# EAGLE schematic V4-AddRS485-1W-V01-016-defect (EAGLE 9.1.1)
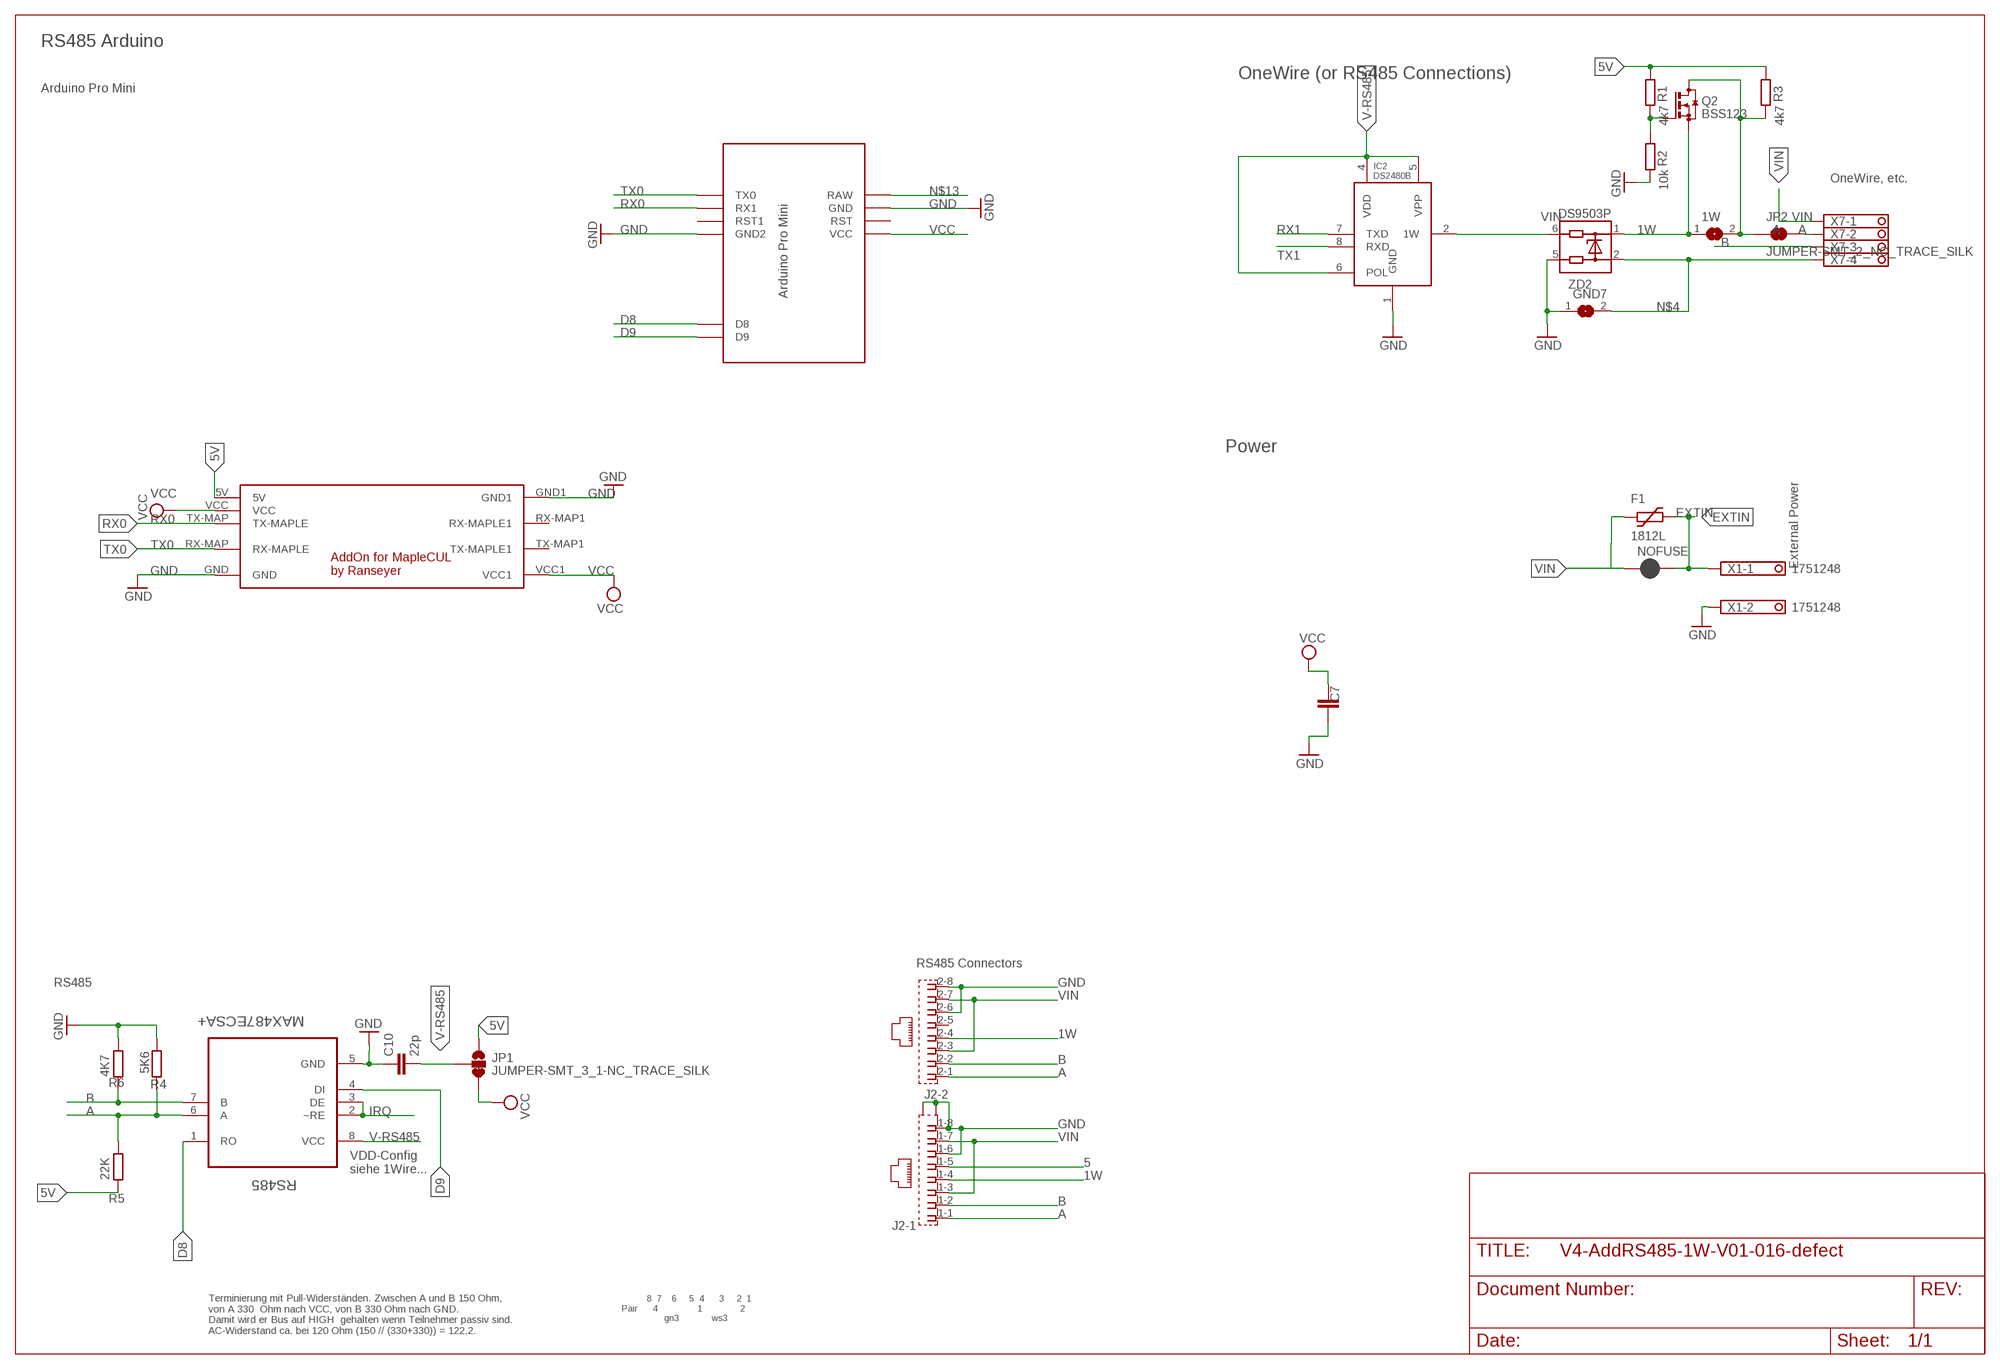
[diagram p0: schematic, sheet 1]

## Parts
1W  SJ  [SJ]
C7  C-EUC1812  [C1812]
C10  22p  C-EUC0805  [C0805]
F1  1812L  [1812L]
GND7  SJ  [SJ]
IC2  DS2480B  [SO08]
J2  RJ45_2X_S  [RJ45_2X_S]
JP1  JUMPER-SMT_3_1-NC_TRACE_SILK  [SMT-JUMPER_3_1-NC_TRACE_SILK]
JP2  JUMPER-SMT_2_NC_TRACE_SILK  [SMT-JUMPER_2_NC_TRACE_SILK]
NOFUSE  JUMPER-SMT_2_NC_PASTE_NO-SILK  [SMT-JUMPER_2_NC_PASTE_NO-SILK]
Q2  BSS123  [SOT23]
R1  4k7  R-EU_R0805  [R0805]
R2  10k  R-EU_R0805  [R0805]
R3  4k7  R-EU_R0805  [R0805]
R4  5K6  R-EU_R0805  [R0805]
R5  22K  R-EU_R0805  [R0805]
R6  4K7  R-EU_R0805  [R0805]
RS485  MAX487ECSA+  [SOIC127P600X175-8N]
U$2  MAPLE-CUL-ADDON-V01  [MAPLE-CUL-V01]
U$3  MARTIN-PRO-MINI-RS485  [MARTIN-PRO-MINI-RS485]
X1  1751248  [1751248]
X7  1751264  [1751264]
ZD2  DS9503P  [TSOC6]

## Nets
1W: 1W.1 J2.1-4 J2.2-4 Q2.2(S) ZD2.1
5: J2.1-5
5V: JP1.1 R1.1 R3.1 R5.1 U$2.5V
A: 1W.2 J2.1-1 J2.2-1 JP2.1 JP2.2 Q2.3(D) R3.2 R4.2 R5.2 RS485.6(A) X7.2
B: J2.1-2 J2.2-2 R6.1 RS485.7(B) X7.3
D8: RS485.1(RO) U$3.D8
D9: RS485.4(DI) U$3.D9
EXTIN [PWR]: F1.P$2 NOFUSE.2 X1.1
GND [PWR]: C7.1 C10.1 GND7.1 IC2.1(GND) J2.1-6 J2.1-8 J2.2-6 J2.2-8 J2.G1(-1:S2) J2.G3(-1:S1) R2.2 R4.1 R6.2 RS485.5(GND) U$2.GND U$2.GND1 U$3.GND U$3.GND1(GND2) X1.2 ZD2.5
IRQ: RS485.2(~RE) RS485.3(DE)
N$1: C10.2 JP1.2
N$3: IC2.2(1W) ZD2.6
N$4 [PWR]: GND7.2 X7.4 ZD2.2
N$6: Q2.1(G) R1.2 R2.1
N$13: U$3.RAW
RX0: U$2.TX-MAP(TX-MAPLE) U$3.RX1
RX1: IC2.7(TXD)
TX0: U$2.RX-MAP(RX-MAPLE) U$3.TX0
TX1: IC2.8(RXD)
V-RS485 [PWR]: IC2.4(VDD) IC2.5(VPP) IC2.6(POL) RS485.8(VCC)
VCC [PWR]: C7.2 JP1.3 U$2.VCC U$2.VCC1 U$3.VCC
VIN [PWR]: F1.P$1 J2.1-3 J2.1-7 J2.2-3 J2.2-7 NOFUSE.1 X7.1
Unconnected: J2.2-5 U$2.RX-MAP1(RX-MAPLE1) U$2.TX-MAP1(TX-MAPLE1) U$3.RST U$3.RST1

## Notes on the sheet
- RS485 Arduino
- OneWire (or RS485 Connections)
- Arduino Pro Mini
- OneWire, etc.
- Power
- External Power
- RS485 Connectors
- RS485
- VDD-Config
  siehe 1Wire...
- 8  7    6     5  4      3     2  1
  Pair      4                1               2
                   gn3             ws3
- Terminierung mit Pull-Widerständen. Zwischen A und B 150 Ohm,
  von A 330  Ohm nach VCC, von B 330 Ohm nach GND. 
  Damit wird er Bus auf HIGH  gehalten wenn Teilnehmer passiv sind.
  AC-Widerstand ca. bei 120 Ohm (150 // (330+330)) = 122,2.

## Library data of the parts
1W GND7 = jumper:SJ: SMD solder JUMPER
C7 = rcl:C-EU: CAPACITOR, European symbol; SPICEPREFIX: C
C10 = rcl:C-EU: CAPACITOR, European symbol
F1 = ptc-littlefuse:1812L
IC2 = 1wire:DS2480B: RS232 to 1-Wire Host Adapter/Line Driver with Load Sensor This device is a onewire host and UART interface in one chip. It provides the complete DC/AC requirements for onewire communication, including overdrive speed mode and 12V EPROM programming. On the UART side, it can operate at 9.6kBaud (default), 19.2kBaud, 57.6kBaud, and 115.2kBaud. The RxD and TxD lines are operated at 0V/5V. The POL pin selects the RxD and TxD "polarity", that means straight-through or inverted. If POL is connected to GND, RxD and TxD behave properly for connection to inverted RS232 drivers, like the MC1488/1489 or MAX23x chips. If POL is connected to Vdd, RxD and TxD behave properly for direct connection to a 0V/5V UART chip. Important Notes: RxD and TxD are seen from the UART point of view, that means the DS2480B TxD pin is really an input and the DS2480B RxD pin is really an output. Vpp must be connected to 5V/Vdd if EPROM programming is not required. Vdd must be always lower than or equal to Vpp, otherwise the chip will be damaged. Best idea is to provide a separate 12V->5V/5mA voltage regulator from Vpp to Vdd if EPROM programming is required. Author: Jan Kandziora <jjj@gmx.de>
J2 = RJ45:RJ45_2X_S: AMP connector
JP1 = SparkFun-Jumpers:JUMPER-SMT_3_1-NC_TRACE: Normally closed trace jumper (1 of 2 connections) This jumper has a trace between two pads so it's normally closed (NC). The other connection is normally open (NO). Use a razor knife to open the connection. For best results follow the IPC guidelines for cutting traces: Cutout at least 0.063 mm (0.005 in). Remove all loose material to clean up the cut area. Seal the cut with an approved epoxy. Reapply solder to reclose the connection, or to close the NO connection.
JP2 = SparkFun-Jumpers:JUMPER-SMT_2_NC_TRACE: Normally closed trace jumper This jumper has a trace between two pads so it's normally closed (NC). Use a razor knife to open the connection. For best results follow the IPC guidelines for cutting traces: Cutout at least 0.063 mm (0.005 in). Remove all loose material to clean up the cut area. Seal the cut with an approved epoxy. Reapply solder to reclose the connection.
NOFUSE = SparkFun-Jumpers:JUMPER-SMT_2_NC_PASTE: Normally closed solder jumper This jumper has an aperture in the stencil to allow solder paste to bridge the split in the wire so it's normally closed (NC). Wick off the solder to open the connection. Reapply solder to reclose the connection.
Q2 = transistor-small-signal:BSS123: N-CHANNEL MOS FET
R1-R6 = rcl:R-EU_: RESISTOR, European symbol
RS485 = Maxim_By_element14_Batch_1:MAX487ECSA+: Low-Power, Slew-Rate-Limited RS-485/RS-422 Transceivers; MPN: MAX487ECSA+; OC_FARNELL: 9724532; OC_NEWARK: 68K4803; PACKAGE: SOIC-8; SUPPLIER: Maxim
U$2 = Martin-Communication-V4:MAPLE-CUL-ADDON-V01: AddOn for MAPLE-CUL V4.x
U$3 = Arduino-clone:MARTIN-PRO-MINI-RS485: ABK Pro-Mini Arduino Clone
X1 = con-phoenix-350:1751248: MKDS 1/ 2-3,5 Printklemme Nennstrom: 10 A Bemessungsspannung: 160 V Raster: 3,5 mm Polzahl: 2 Montageart: Löten Anschlussart: Schraubanschluss Anschlussrichtung vom Leiter zur Platine: 0° Source: http://eshop.phoenixcontact.com .. 1751248.pdf; OC_FARNELL: unknown; OC_NEWARK: unknown
X7 = con-phoenix-350:1751264: MKDS 1/ 4-3,5 Printklemme Nennstrom: 10 A Bemessungsspannung: 160 V Raster: 3,5 mm Polzahl: 4 Montageart: Löten Anschlussart: Schraubanschluss Anschlussrichtung vom Leiter zur Platine: 0° Source: http://eshop.phoenixcontact.com .. 1751264.pdf; MPN: 1751264; OC_FARNELL: unknown; OC_NEWARK: 10R0934
ZD2 = 1wire:DS9503: ESD Protection Diode with Resistors This ESD protection diode is designed especially for onewire host interfaces. Unlike the DS9502, it has two additional 5Ohm resitors in the 1W and GND line. Pin 5 and 6 have to be connected to the host side, pin 1 und 2 to the network side. The 1W line is through pin 1 and 6, the GND line is through pin 2 and 5. Author: Jan Kandziora <jjj@gmx.de>

## Net classes
0 default: width 0.305 mm, drill 0.051 mm, clearance 0.051 mm
1 PWR: width 0.457 mm, drill 0.051 mm, clearance 0.051 mm